# EasyEDA Pro project pdb.eprj, schematic input-12-50
Board Name: input-12-50; Create Date: 2025-12-14; Page Name: P1; Project Name: pdb; Schematic Name: input-12-50; Update Date: 2025-12-16; Company: EasyEDA.com; Page Size: A4; Version: V1.0
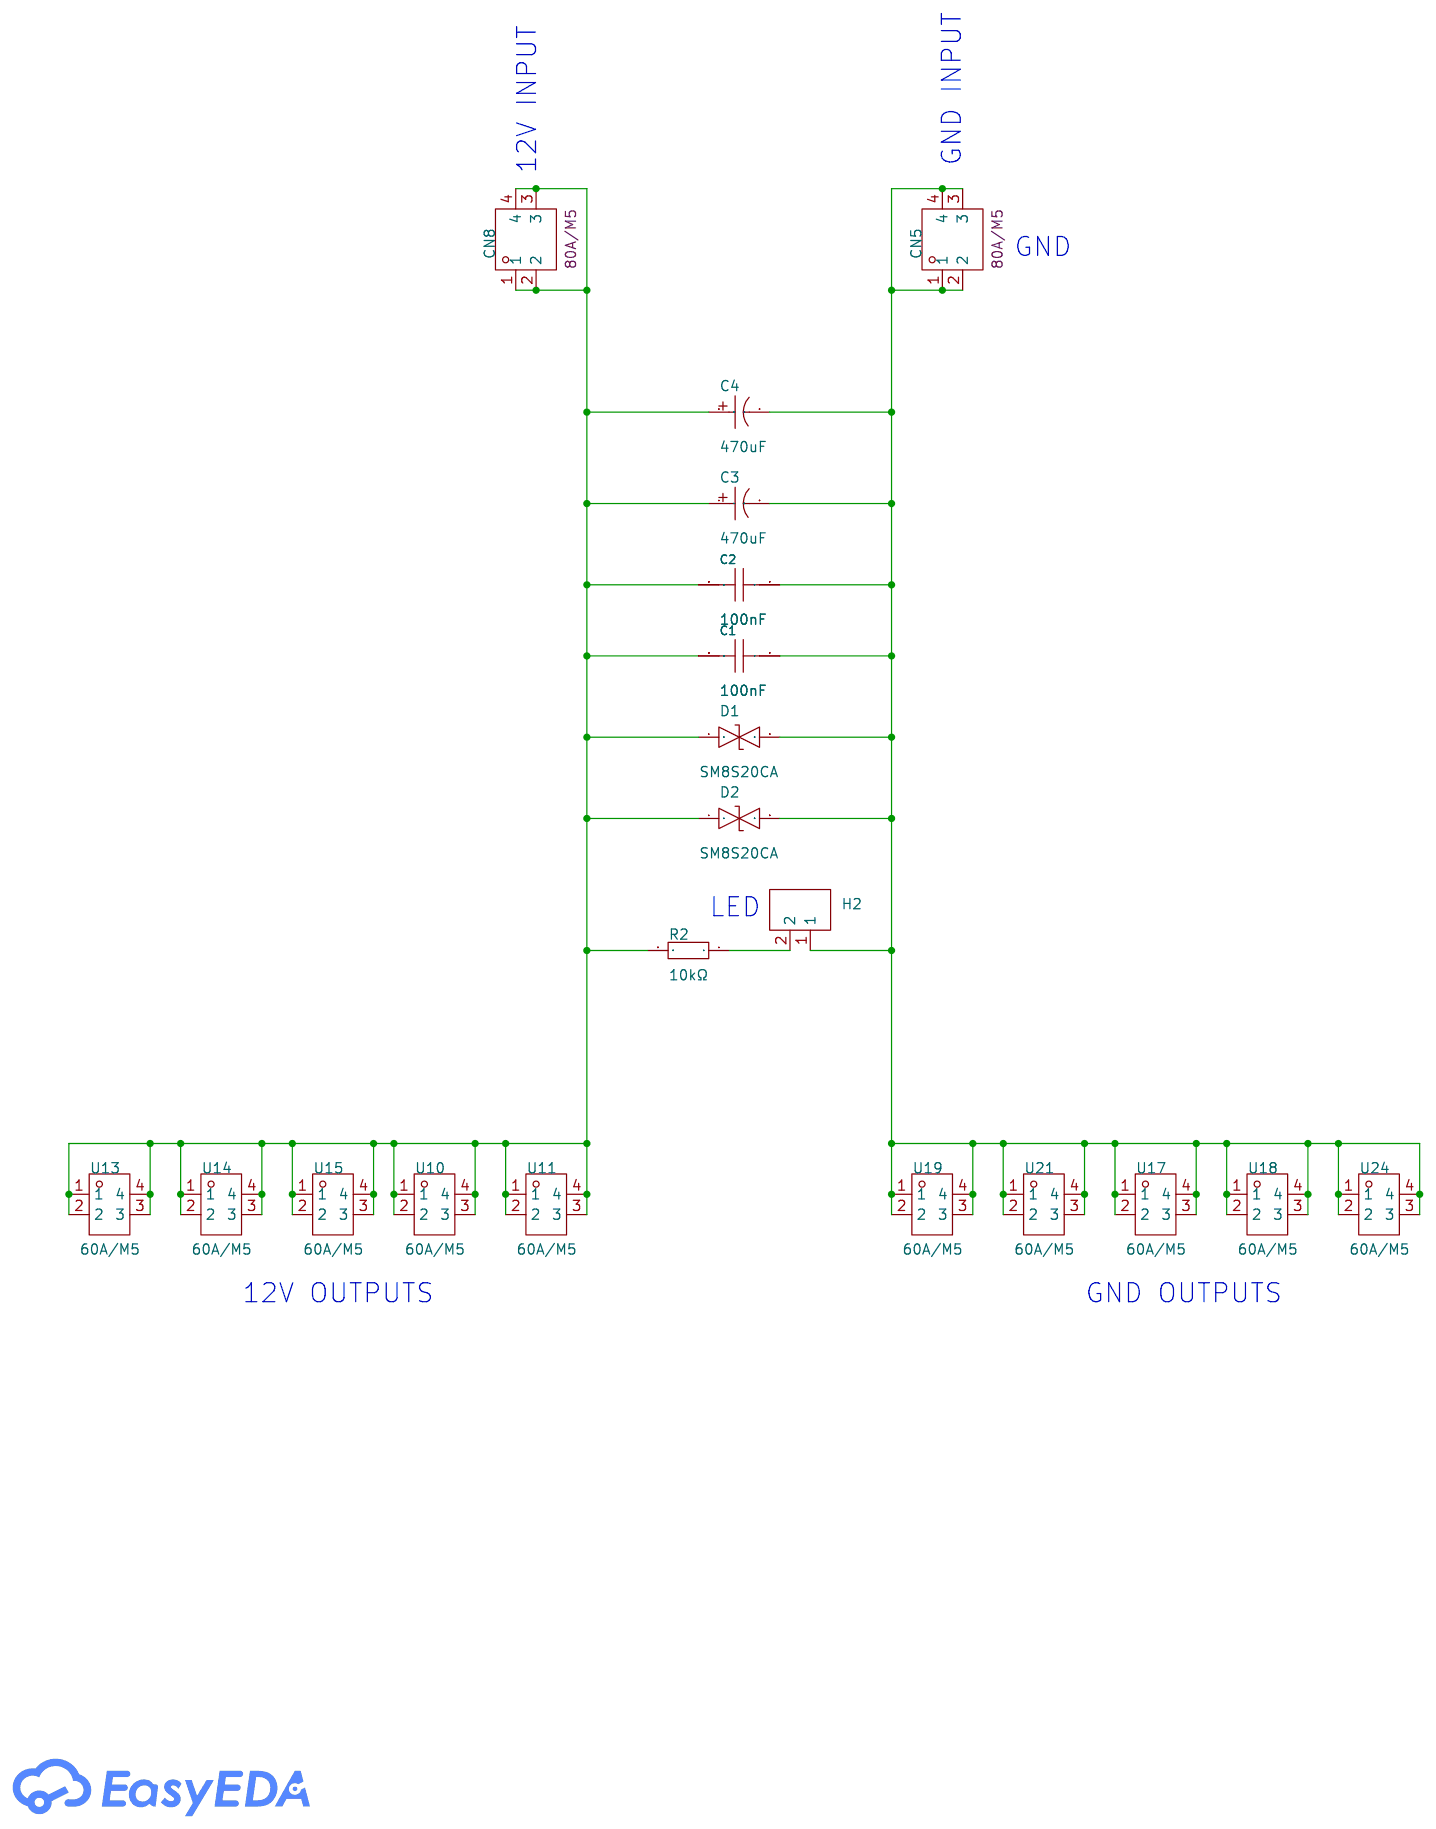
[diagram p0: schematic sheet]

## Parts
C1  100nF  [C1210]
C2  100nF  [C1210]
C3  470uF  [CAP-TH_BD10.0-P5.00-D1.0-FD]
C4  470uF  [CAP-TH_BD10.0-P5.00-D1.0-FD]
CN5  80A/M5  [CONN-TH_T54120117-1300]
CN8  80A/M5  [CONN-TH_T54120117-1300]
D1  SM8S20CA  [DO-218AB_L13.5-W8.4-LS15.5-BI]
D2  SM8S20CA  [DO-218AB_L13.5-W8.4-LS15.5-BI]
H2  PZ254V-11-02P  [HDR-TH_2P-P2.54-V-M]
R2  10kΩ  [R1206]
U10  60A/M5  [TH_4P-L11.1-W9.2-P5.00]
U11  60A/M5  [TH_4P-L11.1-W9.2-P5.00]
U13  60A/M5  [TH_4P-L11.1-W9.2-P5.00]
U14  60A/M5  [TH_4P-L11.1-W9.2-P5.00]
U15  60A/M5  [TH_4P-L11.1-W9.2-P5.00]
U17  60A/M5  [TH_4P-L11.1-W9.2-P5.00]
U18  60A/M5  [TH_4P-L11.1-W9.2-P5.00]
U19  60A/M5  [TH_4P-L11.1-W9.2-P5.00]
U21  60A/M5  [TH_4P-L11.1-W9.2-P5.00]
U24  60A/M5  [TH_4P-L11.1-W9.2-P5.00]

## Library data of the parts
C1 C2 = 1210B104K501CT: LCSC Part Name: 100nF ±10% 500V; Supplier Part: C304008; Manufacturer: Walsin(华新科); Supplier Footprint: 1210; JLCPCB Part Class: Extended Part; Datasheet: https://atta.szlcsc.com/upload/public/pdf/source/20181106/C328909_7C08FD405CB49CEB23FBF6F868428209.pdf; Supplier: LCSC; Tolerance: ±10%
C3 C4 = 50PX470MEFC10X20: LCSC Part Name: 470uF ±20% 50V; Supplier Part: C88733; Manufacturer: Rubycon(红宝石); Supplier Footprint: 插件,D10xL20mm; JLCPCB Part Class: Extended Part; Datasheet: https://item.szlcsc.com/datasheet/50PX470MEFC10X20/89913.html; Supplier: LCSC; Tolerance: ±20%; Voltage Rating: 50V; Pin Spacing: 5mm; Diameter: 10mm; Height - Seated (Max): 20mm; Lifetime: 2000hrs@105℃; Operating Temperature: -25℃~+105℃
CN5 CN8 = T54120117-1300: LCSC Part Name: PCB焊接端子抽牙M5 四脚 12*11.7*13mm T1.5 镀亮锡; Supplier Part: C19724558; Manufacturer: XFCN(兴飞); Supplier Footprint: 插件; JLCPCB Part Class: Extended Part; Datasheet: https://item.szlcsc.com/datasheet/T54120117-1300/21043657.html; Supplier: LCSC; Screw Hole Size: M5; Number of Leg: 4
D1 D2 = SM8S20CA: LCSC Part Name: 双向TVS 20V截止 204A峰值脉冲; Supplier Part: C557519; Manufacturer: DOWO(东沃); Supplier Footprint: DO-218AB; JLCPCB Part Class: Extended Part; Datasheet: https://atta.szlcsc.com/upload/public/pdf/source/20200521/C557515_E6C167C5FE746524E8964280E01514FD.pdf; Supplier: LCSC; Reverse Stand-Off Voltage (Vrwm): 20V; Maximum Clamping Voltage: 32.4V; Peak Pulse Current (Ipp)@10/1000us: 204A; Breakdown Voltage: 22.2V; Reverse Leakage Current (Ir): 150uA; Type: TVS
H2 = PZ254V-11-02P: Pin Structure:1x2P Pitch:2.54mm Row Spacing:- Circluar Pins/Square Pins:Pin Header Mounting Type:Through Hole Number of Rows:1 Number of Pins:2P Current Rating:- Voltage Rating (Max):- Length of Mating Pin:6mm Insulation Height:2.5mm Length of End Connect; LCSC Part Name: 1x2P 间距:2.54mm 方针 直插; Supplier Part: C492401; Manufacturer: XFCN(兴飞); Supplier Footprint: 插件,P=2.54mm; JLCPCB Part Class: Extended Part; Datasheet: https://item.szlcsc.com/datasheet/PZ254V-11-02P/502957.html; Supplier: LCSC; Pin Structure: 1x2P; Pitch: 2.54mm; Circluar Pins/Square Pins: Pin Header; Mounting Type: Through Hole; Number of Rows: 1; Number of Pins: 2P; Length of Mating Pin: 6mm; Insulation Height: 2.5mm; Length of End Connection Pin: 3mm; Contact Material: Brass; Operating Temperature: -40℃~+105℃; Color: Black
R2 = 1206W4F1002T5E: Type:Thick Film Resistor Resistance:10kΩ Tolerance:±1% Tolerance:±1% Power(Watts):250mW Voltage-Supply(Max):200V Temperature Coefficient:±100ppm/℃ Temperature Coefficient:±100ppm/℃ Operating Temperature:-55℃~+155℃ Operating Temperature:-55℃~+155℃; LCSC Part Name: 10kΩ ±1% 250mW 厚膜电阻; Supplier Part: C17902; Manufacturer: UNI-ROYAL(厚声); Supplier Footprint: 1206; JLCPCB Part Class: Basic Part; Datasheet: https://item.szlcsc.com/datasheet/1206W4F1002T5E/18590.html; Supplier: LCSC; Type: Thick Film Resistor; Tolerance: ±1%; Power(Watts): 250mW; Voltage-Supply(Max): 200V; Temperature Coefficient: ±100ppm/℃; Operating Temperature: -55℃~+155℃
U10 U11 U13-U15 U17-U19 U21 U24 = TM54111092-1250: LCSC Part Name: PCB焊接端子 压铆螺母 M5  四脚 11.1x9.2x12.5mm; Supplier Part: C7496724; Manufacturer: XFCN(兴飞); Supplier Footprint: 插件; JLCPCB Part Class: Extended Part; Datasheet: https://item.szlcsc.com/datasheet/TM54111092-1250/8562990.html; Supplier: LCSC; Screw Hole Size: M5; Number of Leg: 4

## Nets
$1N6693: H2.2 R2.1
$1N7376: C1.2 C2.2 C3.1 C4.1 CN8.1 CN8.2 CN8.3 CN8.4 D1.1 D2.1 R2.2 U10.1 U10.2 U10.3 U10.4 U11.1 U11.2 U11.3 U11.4 U13.1 U13.2 U13.3 U13.4 U14.1 U14.2 U14.3 U14.4 U15.1 U15.2 U15.3 U15.4
$1N8626: C1.1 C2.1 C3.2 C4.2 CN5.1 CN5.2 CN5.3 CN5.4 D1.2 D2.2 H2.1 U17.1 U17.2 U17.3 U17.4 U18.1 U18.2 U18.3 U18.4 U19.1 U19.2 U19.3 U19.4 U21.1 U21.2 U21.3 U21.4 U24.1 U24.2 U24.3 U24.4

## Notes on the sheet
- 12V INPUT
- GND INPUT
- GND
- LED
- 12V OUTPUTS
- GND OUTPUTS
